# EasyEDA schematic SCH_Club-Vote-Decider_2025-12-05 (2).json
TITLE: Sheet_1; REV: 1.0; Date: 2025-12-04; Sheet: 1/1; Drawn By: kaushikc2008; Company: Your Company
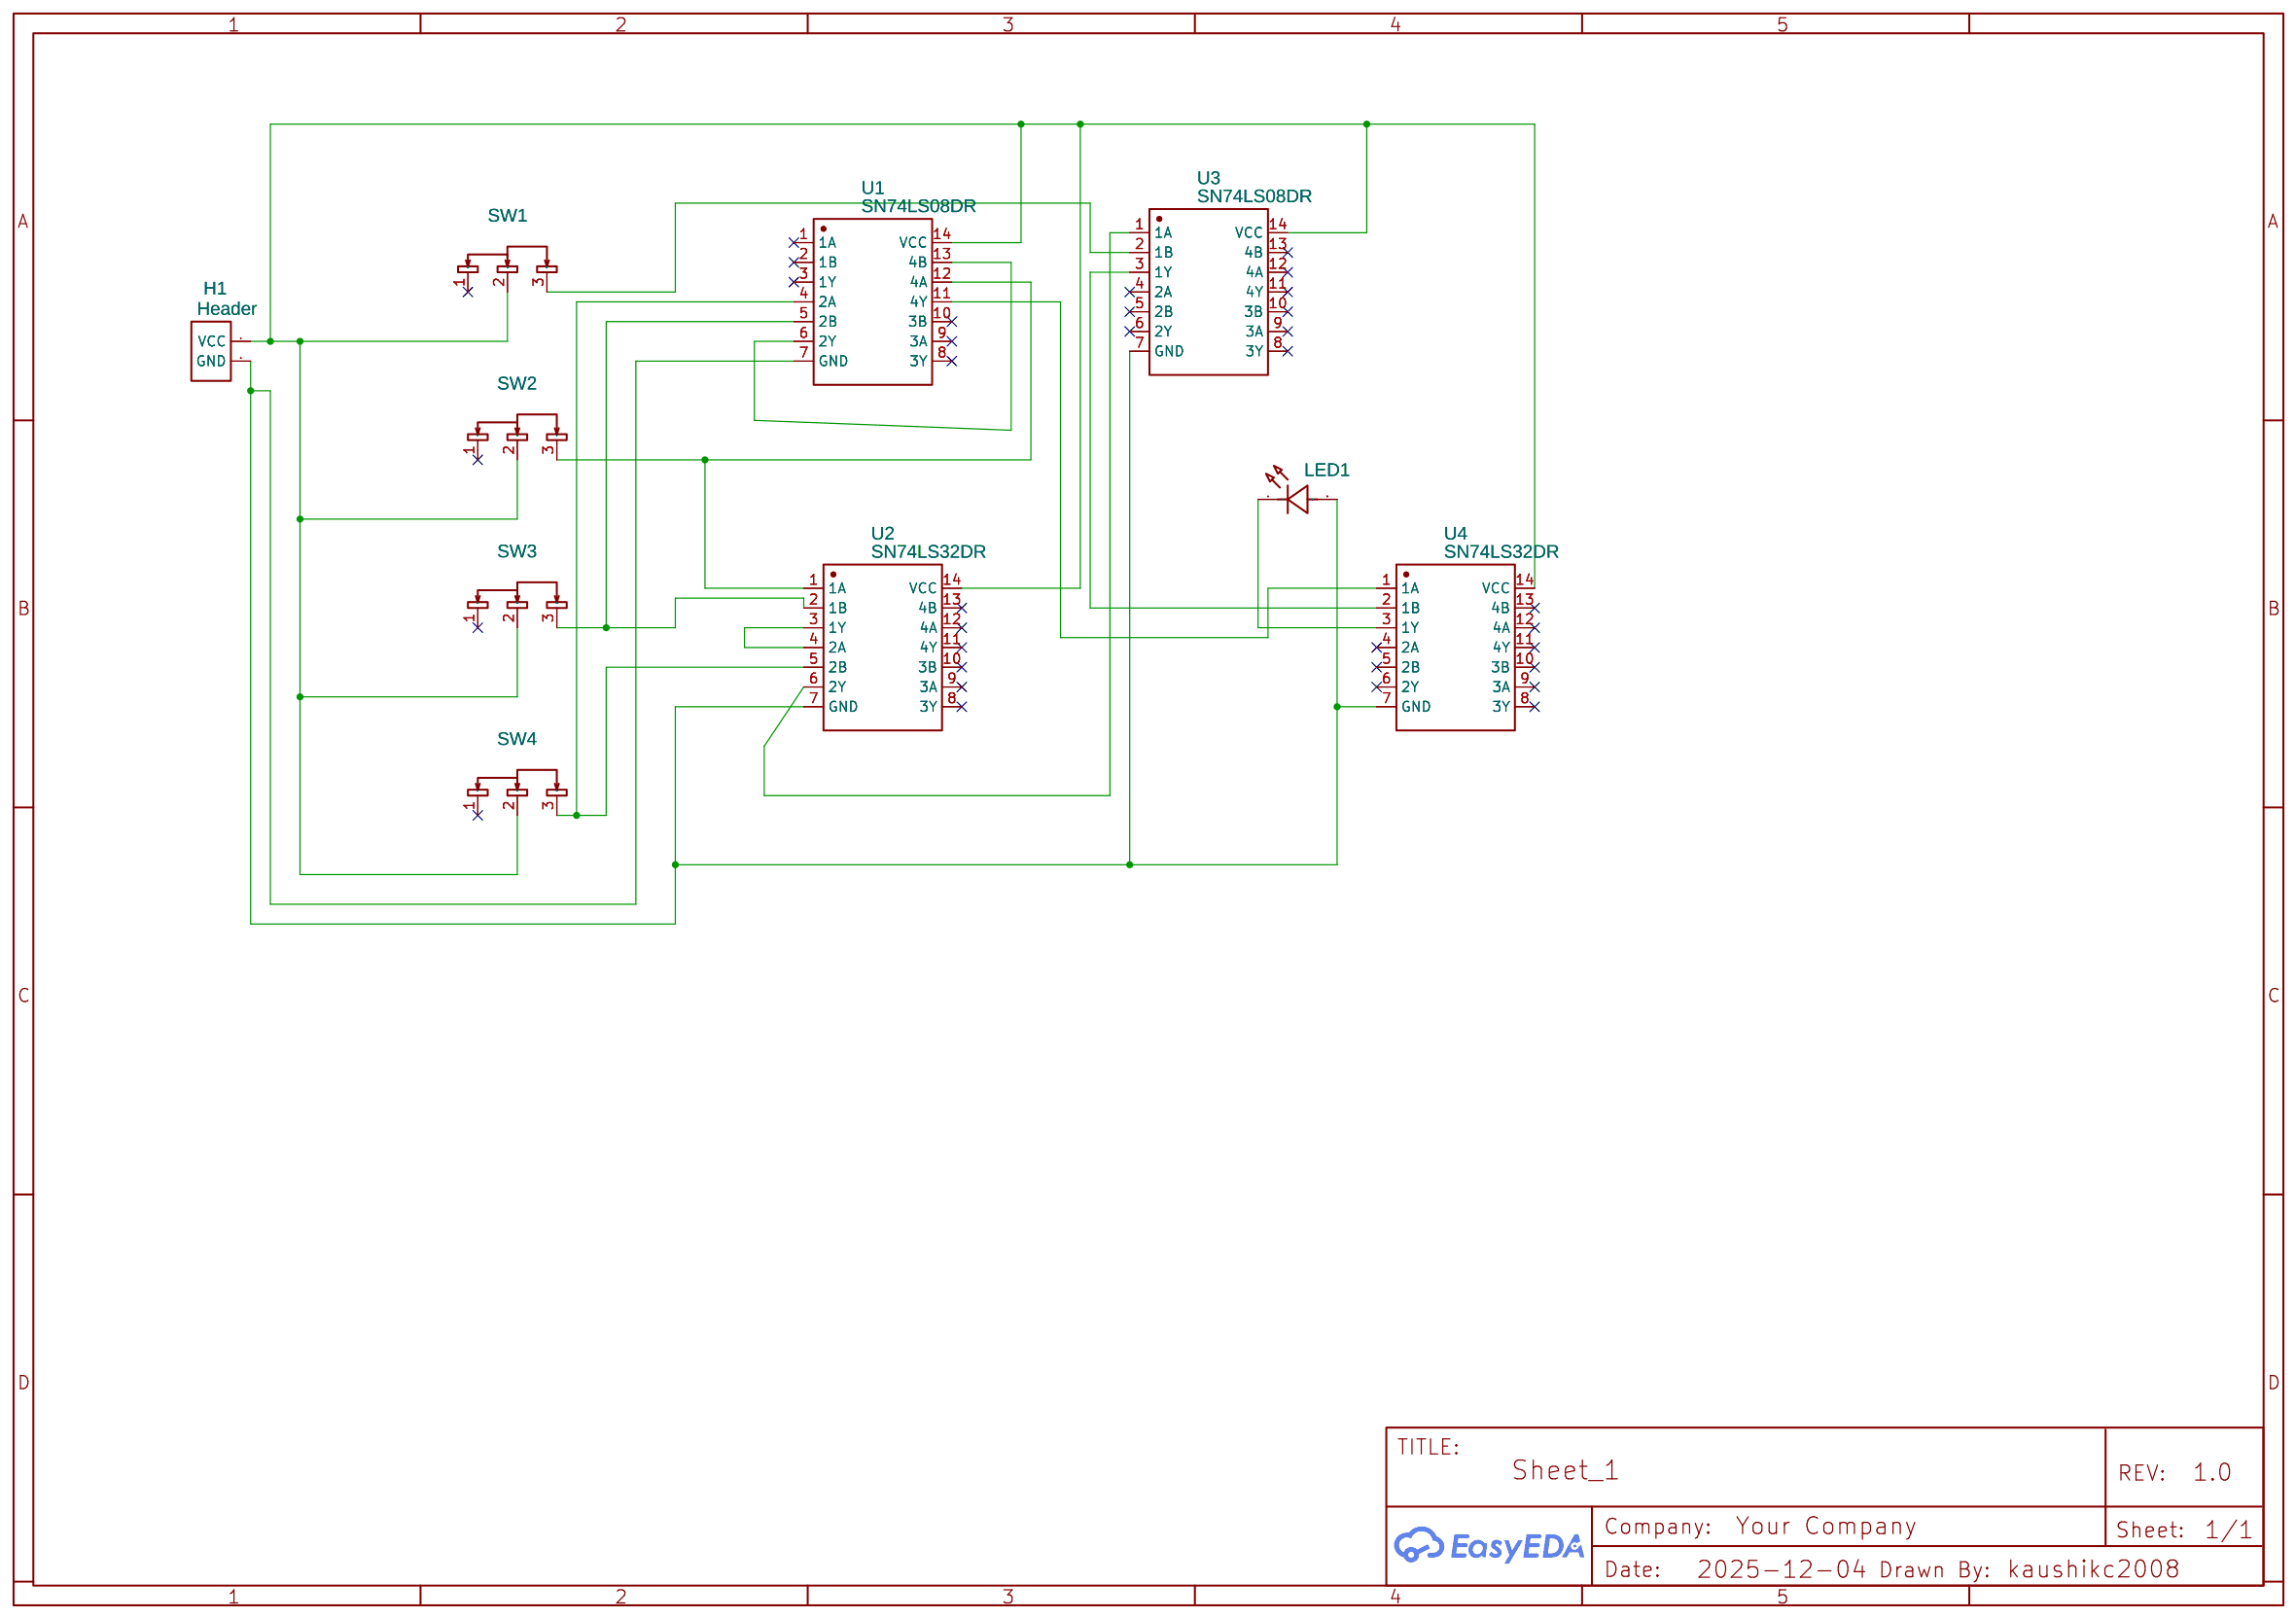
[diagram p0: schematic sheet]

## Parts
H1  Header  [HDR-M-2.54_1X2]
LED1  XL-502UWC  [LED-TH_BD5.9-P2.54-RD_WHITE]
SW1  MST-12D18G4 SPDT SLIDE SWITCH  [SW-SMD_MST-12D18G4-SPDT-SLIDE-SWITCH]
SW2  MST-12D18G4 SPDT SLIDE SWITCH  [SW-SMD_MST-12D18G4-SPDT-SLIDE-SWITCH]
SW3  MST-12D18G4 SPDT SLIDE SWITCH  [SW-SMD_MST-12D18G4-SPDT-SLIDE-SWITCH]
SW4  MST-12D18G4 SPDT SLIDE SWITCH  [SW-SMD_MST-12D18G4-SPDT-SLIDE-SWITCH]
U1  SN74LS08DR  [SOIC-14_L8.7-W3.9-P1.27-LS6.0-BL]
U2  SN74LS32DR  [SOIC-14_L8.7-W3.9-P1.27-LS6.0-BL]
U3  SN74LS08DR  [SOIC-14_L8.7-W3.9-P1.27-LS6.0-BL]
U4  SN74LS32DR  [SOIC-14_L8.7-W3.9-P1.27-LS6.0-BL]

## Library data of the parts
H1 = HEADER-FEMALE-2.54_1X2: Contributor: aquawarrior; Supplier: LCSC; Supplier Part: C492401; Package Display: No
LED1 = XL-502UWC: Contributor: LCSC; Supplier: LCSC; Supplier Part: C2895480; Manufacturer: XINGLIGHT(成兴光); JLCPCB Part Class: Extended Part
SW1-SW4 = MST-12D18G4 SPDT SLIDE SWITCH: Supplier: LCSC; Supplier Part: C49023767; Manufacturer: SHOU HAN(首韩); Manufacturer Part: MST-12D18G4 SPDT Slide Switch; JLCPCB Part Class: Extended Part; Contributor: lcsc
U1 U3 = SN74LS08DR: Supplier: LCSC; Manufacturer: TI(德州仪器); Supplier Part: C6802; JLCPCB Part Class: Extended Part
U2 U4 = SN74LS32DR: Contributor: LCSC; Supplier: LCSC; Manufacturer: TI(德州仪器); Supplier Part: C116812; JLCPCB Part Class: Extended Part

## Nets
Net-(H1-1): H1.1(VCC) SW1.2 SW2.2 SW3.2 SW4.2 U1.14(VCC) U2.14(VCC) U3.14(VCC) U4.14(VCC)
Net-(H1-2): H1.2(GND) LED1.2(A) U1.7(GND) U2.7(GND) U3.7(GND) U4.7(GND)
Net-(LED1-1): LED1.1(K) U4.3(1Y)
Net-(SW1-3): SW1.3 U3.2(1B)
Net-(SW2-3): SW2.3 U1.12(4A) U2.1(1A)
Net-(SW3-3): SW3.3 U1.5(2B) U2.2(1B)
Net-(SW4-3): SW4.3 U1.4(2A) U2.5(2B)
Net-(U1-6): U1.6(2Y) U1.13(4B)
Net-(U1-11): U1.11(4Y) U4.1(1A)
Net-(U2-3): U2.3(1Y) U2.4(2A)
Net-(U2-6): U2.6(2Y) U3.1(1A)
Net-(U3-3): U3.3(1Y) U4.2(1B)

Not connected (* = marked no-connect by the designer): SW1 1*; SW2 1*; SW3 1*; SW4 1*; U1 1(1A)* 2(1B)* 3(1Y)* 8(3Y)* 9(3A)* 10(3B)*; U2 8(3Y)* 9(3A)* 10(3B)* 11(4Y)* 12(4A)* 13(4B)*; U3 4(2A)* 5(2B)* 6(2Y)* 8(3Y)* 9(3A)* 10(3B)* 11(4Y)* 12(4A)* 13(4B)*; U4 4(2A)* 5(2B)* 6(2Y)* 8(3Y)* 9(3A)* 10(3B)* 11(4Y)* 12(4A)* 13(4B)*
